# EAGLE schematic module (EAGLE 6.6.0)
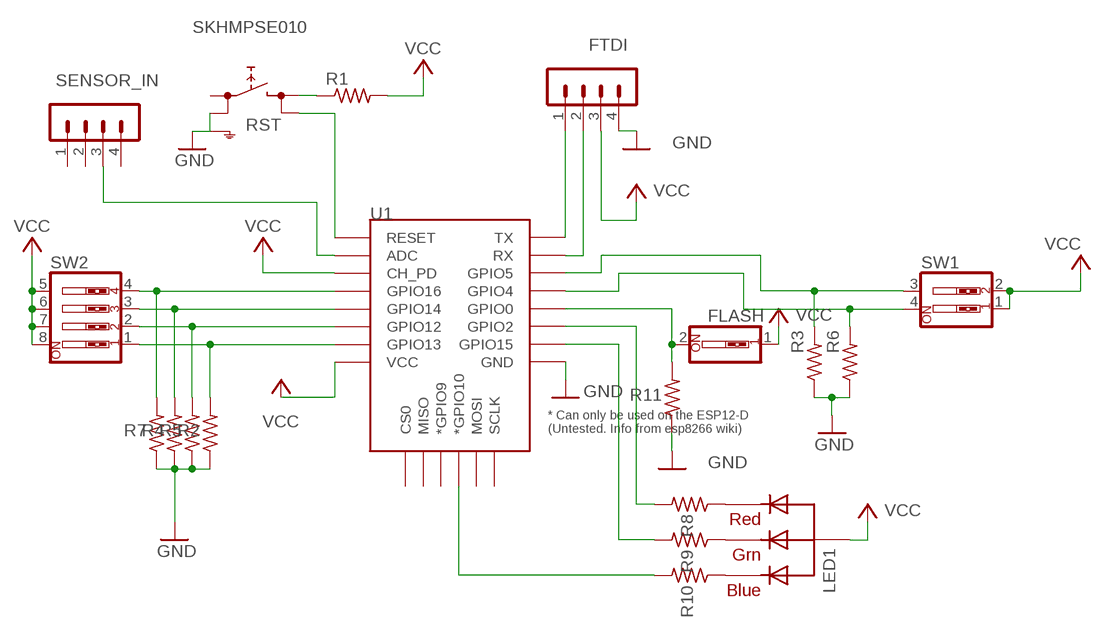
[diagram p0: schematic, sheet 1]

## Parts
FLASH  SW_DIP-1  [EDG-01]
FTDI  MA04-1  [MA04-1]
LED1  RGBLED_CA-5MM  [LED5MMRGB]
R1  R-US_0207/12  [0207/12]
R2  R-US_0207/12  [0207/12]
R3  R-US_0207/12  [0207/12]
R4  R-US_0207/12  [0207/12]
R5  R-US_0207/12  [0207/12]
R6  R-US_0207/12  [0207/12]
R7  R-US_0207/12  [0207/12]
R8  R-US_0207/12  [0207/12]
R9  R-US_0207/12  [0207/12]
R10  R-US_0207/12  [0207/12]
R11  R-US_0207/12  [0207/12]
RST  SKHMPSE010  [SKHMPXE010]
SENSOR_IN  MA04-1  [MA04-1]
SW1  SW_DIP-2  [EDG-02]
SW2  SW_DIP-4  [EDG-04]
U1  ESP12ESMD  [ESP12E-SMD]

## Nets
GND: FTDI.4 R2.1 R3.1 R4.1 R5.1 R6.1 R7.1 R11.1 RST.2(1.2) RST.5(SH) U1.GND
N$1: LED1.1(RED) R8.1
N$2: R7.2 SW2.4 U1.GPIO16
N$3: R3.2 SW1.3 U1.GPIO5
N$4: R4.2 SW2.3 U1.GPIO14
N$5: R5.2 SW2.2 U1.GPIO12
N$6: R6.2 SW1.4 U1.GPIO4
N$7: R2.2 SW2.1 U1.GPIO13
N$8: LED1.3(GREEN) R9.1
N$9: LED1.4(BLUE) R10.1
N$10: FLASH.2 R11.2 U1.GPIO0
N$11: R8.2 U1.GPIO2
N$12: FTDI.1 U1.TXD0(TX)
N$13: FTDI.2 U1.RXD0(RX)
N$14: SENSOR_IN.3 U1.ADC
N$15: R9.2 U1.GPIO15
N$16: R10.2 U1.GPIO10(*GPIO10)
N$20: RST.4(2.2) U1.RESET
N$21: R1.1 RST.3(2.1)
VCC: FLASH.1 FTDI.3 LED1.2(VCC) R1.2 SW1.1 SW1.2 SW2.5 SW2.6 SW2.7 SW2.8 U1.CH_PD U1.VCC
Unconnected: RST.1(1.1) SENSOR_IN.1 SENSOR_IN.2 SENSOR_IN.4 U1.CS0 U1.GPIO9(*GPIO9) U1.MISO U1.MOSI U1.SCLK

## Library data of the parts
FLASH = special:SW_DIP-1: DIP SWITCH
FTDI SENSOR_IN = con-lstb:MA04-1: PIN HEADER; OC_FARNELL: unknown; OC_NEWARK: unknown
LED1 = adafruit:RGBLED_CA: RGB LED, common-anode 5MM Staggered pins 5mm Piranha package http://www.ladyada.net/library/pcb/eaglelibrary.html
R1-R11 = resistor:R-US_: RESISTOR, American symbol
RST = switch:SKHMP*E010: 6.2 X 6.5mm TACT Switch (SMD) Source: http://www3.alps.co.jp/WebObjects/catalog.woa/PDF/E/Switch/Tact/SKHM/SKHM.PDF
SW1 = special:SW_DIP-2: DIP SWITCH
SW2 = special:SW_DIP-4: DIP SWITCH
U1 = esp8266modules:ESP12E: ESP12E Module